# Altium project Proyecto Final.PrjPcb
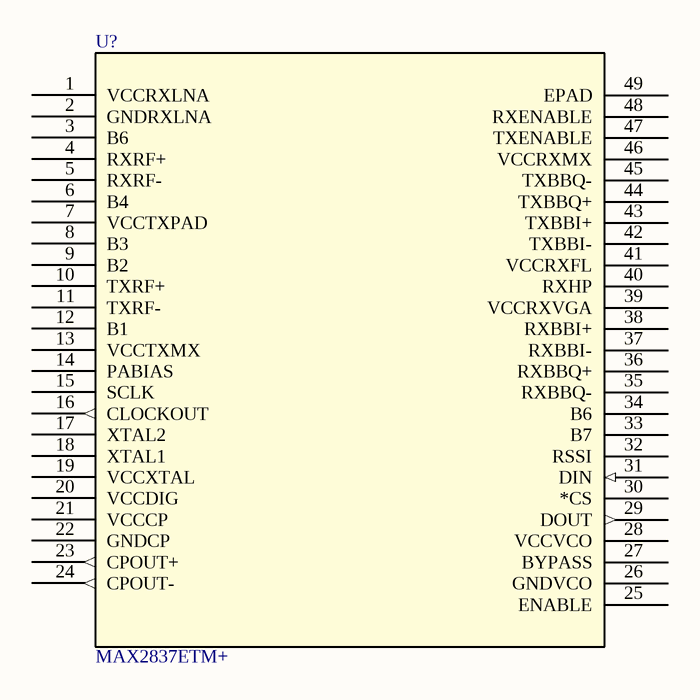
[diagram p0: Esquematico.SchDoc]
1 sheet, 1 parts. Net scope: global (net labels, ports and power ports of the same name join across sheets).

## Sheet Esquematico.SchDoc
size A

### Parts
U?  MAX2837ETM+  [21-0141I_T4866-2_MXM]

### Nets

Not connected (* = marked no-connect by the designer): U? 1(VCCRXLNA) 2(GNDRXLNA) 3(B6) 4(RXRF+) 5(RXRF-) 6(B4) 7(VCCTXPAD) 8(B3) 9(B2) 10(TXRF+) 11(TXRF-) 12(B1) 13(VCCTXMX) 14(PABIAS) 15(SCLK) 16(CLOCKOUT) 17(XTAL2) 18(XTAL1) 19(VCCXTAL) 20(VCCDIG) 21(VCCCP) 22(GNDCP) 23(CPOUT+) 24(CPOUT-) 25(ENABLE) 26(GNDVCO) 27(BYPASS) 28(VCCVCO) 29(DOUT) 30(*CS) 31(DIN) 32(RSSI) 33(B7) 34(B6) 35(RXBBQ-) 36(RXBBQ+) 37(RXBBI-) 38(RXBBI+) 39(VCCRXVGA) 40(RXHP) 41(VCCRXFL) 42(TXBBI-) 43(TXBBI+) 44(TXBBQ+) 45(TXBBQ-) 46(VCCRXMX) 47(TXENABLE) 48(RXENABLE) 49(EPAD)

### Library data of the parts
U? = MAX2837ETM+: No Description Available; Vendor: Maxim Integrated Products; Built_By: EMA_UL_Team; SourceLibrary: Maxim_2014-05-21; Manufacturer_Part_Number: MAX2837ETM+; Copyright: Copyright (C) 2018 Accelerated Designs. All rights reserved; RefDes: RefDes; Type: DEV